# EAGLE design timer (EAGLE 5.07)
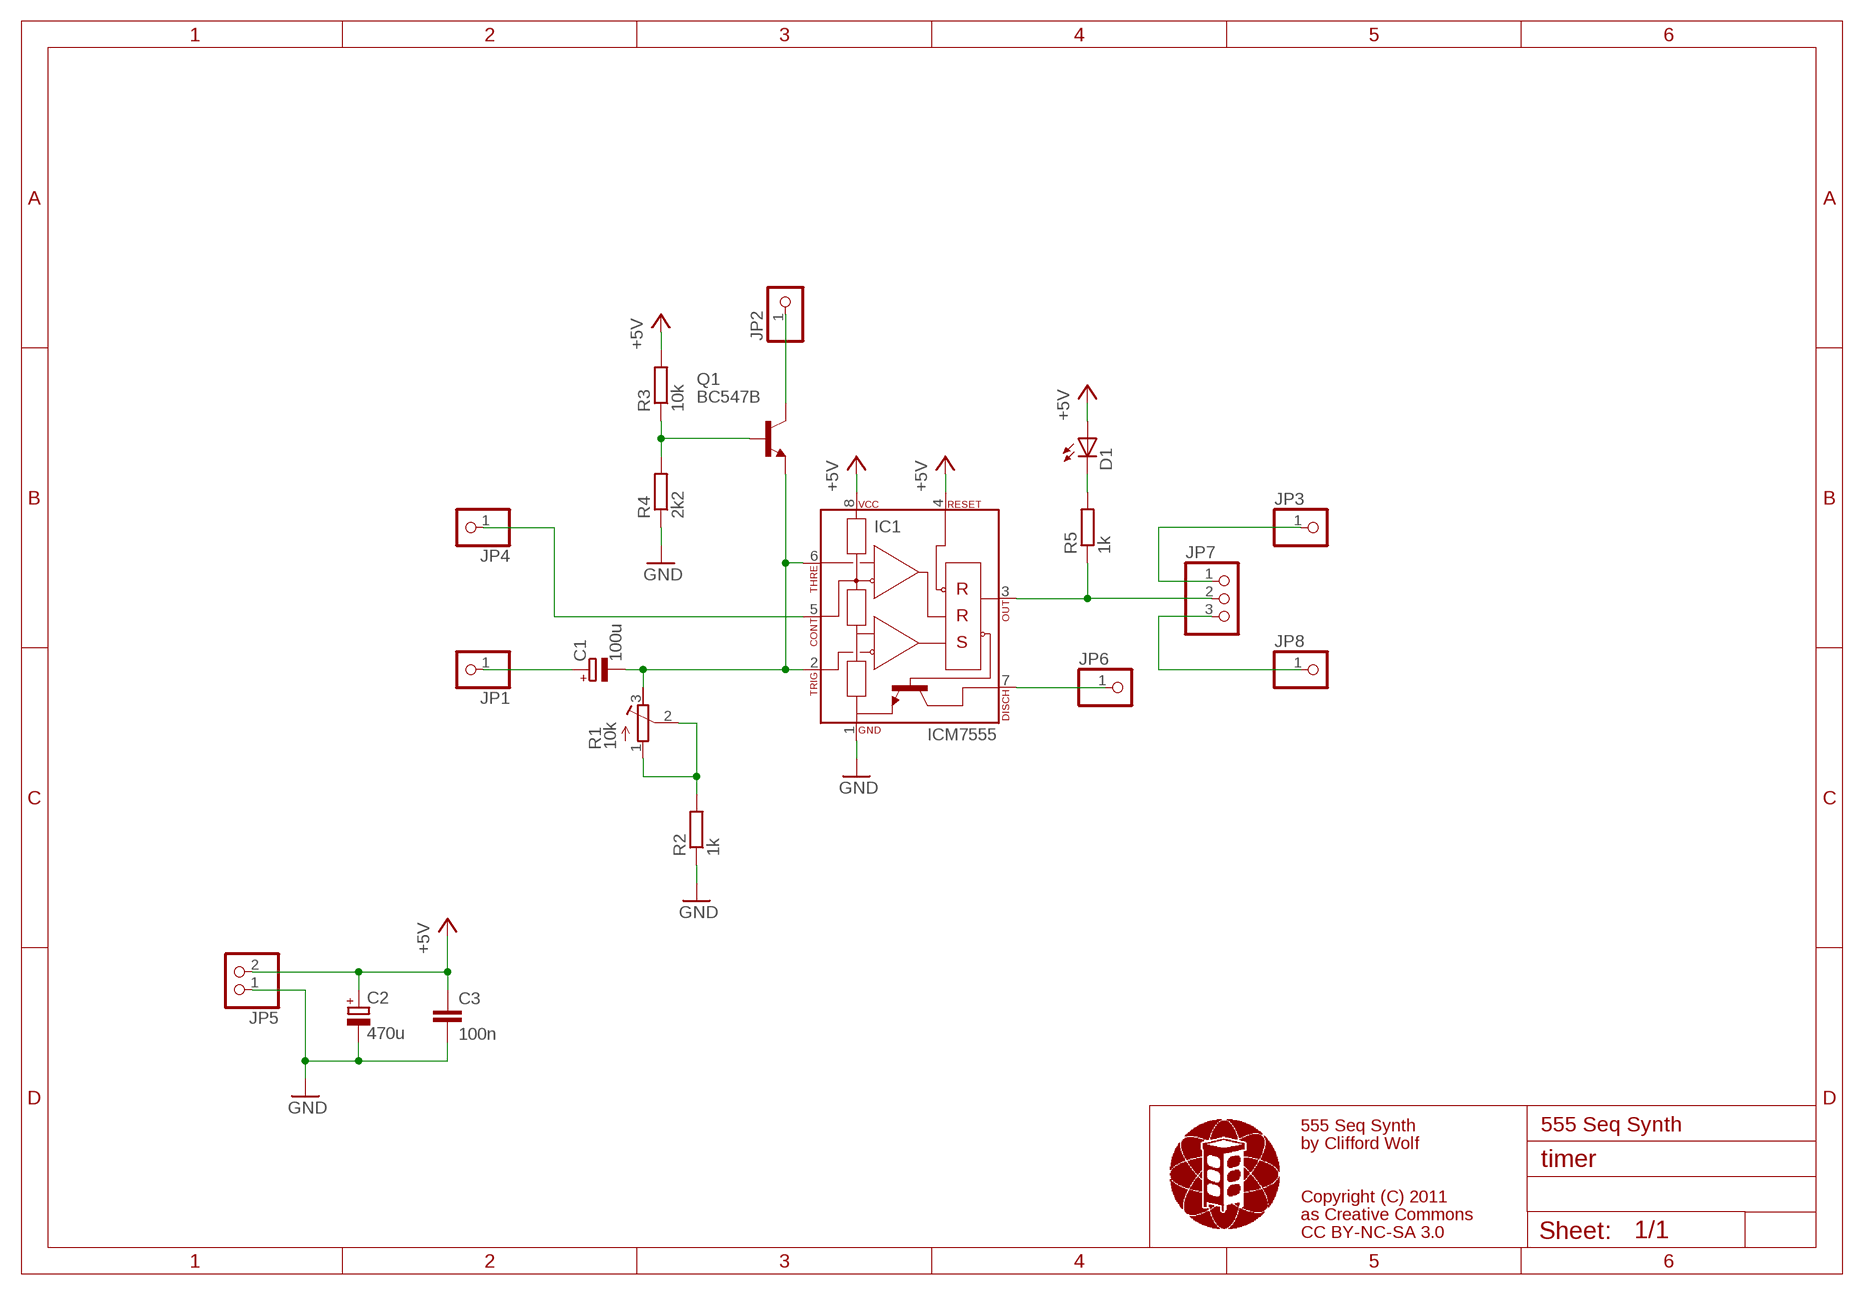
[diagram p0: schematic, sheet 1]

## Parts
C1  100u  CPOLE5-10.5  [E5-10,5]
C2  470u  CPOLE5-10.5  [E5-10,5]
C3  100n  C050-030X075  [C050-030X075]
D1  LED5MM  [LED5MM]
IC1  ICM7555  [DIL08]
JP1  PINHD-1X1  [1X01]
JP2  PINHD-1X1  [1X01]
JP3  PINHD-1X1  [1X01]
JP4  PINHD-1X1  [1X01]
JP5  PINHD-1X2  [1X02]
JP6  PINHD-1X1  [1X01]
JP7  PINHD-1X3  [1X03]
JP8  PINHD-1X1  [1X01]
Q1  BC547B  [TO92]
R1  10k  R-TRIMMRK09K113  [ALPS_RK09K113]
R2  1k  R0309/V  [0309V]
R3  10k  R0309/10  [0309/10]
R4  2k2  R0309/V  [0309V]
R5  1k  R0309/10  [0309/10]

## Nets
+5V: C2.+ C3.1 D1.A IC1.4(RESET) IC1.8(VCC) JP5.2 R3.2
GND: C2.- C3.2 IC1.1(GND) JP5.1 R2.1 R4.1
N$1: C1.+ JP1.1
N$2: C1.- IC1.2(TRIG) IC1.6(THRESH) Q1.1(E) R1.3(A)
N$3: IC1.7(DISCH) JP6.1
N$4: JP3.1 JP7.1
N$5: Q1.2(B) R3.1 R4.2
N$6: JP2.1 Q1.3(C)
N$7: IC1.3(OUT) JP7.2 R5.1
N$8: D1.K(C) R5.2
N$9: IC1.5(CONT) JP4.1
N$10: JP7.3 JP8.1
N$13: R1.1(E) R1.2(S) R2.2

## Notes on the sheet
- 555 Seq Synth | 555 Seq Synth
- by Clifford Wolf
- Copyright (C) 2011
- as Creative Commons
- CC BY-NC-SA 3.0

## Library data of the parts
C1 C2 = mp_passive:CPOL: POLARIZED CAPACITOR, European symbol
C3 = mp_passive:C: CAPACITOR, European symbol
D1 = mp_diode:LED: LED (5mm)
IC1 = mp_miscic:ICM7555: ICM7555 universal RC timer
JP1-JP4 JP6 JP8 = mpc_pinhead:PINHD-1X1: PIN HEADER
JP5 = mpc_pinhead:PINHD-1X2: PIN HEADER
JP7 = mpc_pinhead:PINHD-1X3: PIN HEADER
Q1 = mp_transistor:BC547B: NPN Transistor
R1 = mp_switch:R-TRIMM: Trimm resistor
R2-R5 = mp_passive:R: RESISTOR, European symbol

## Board
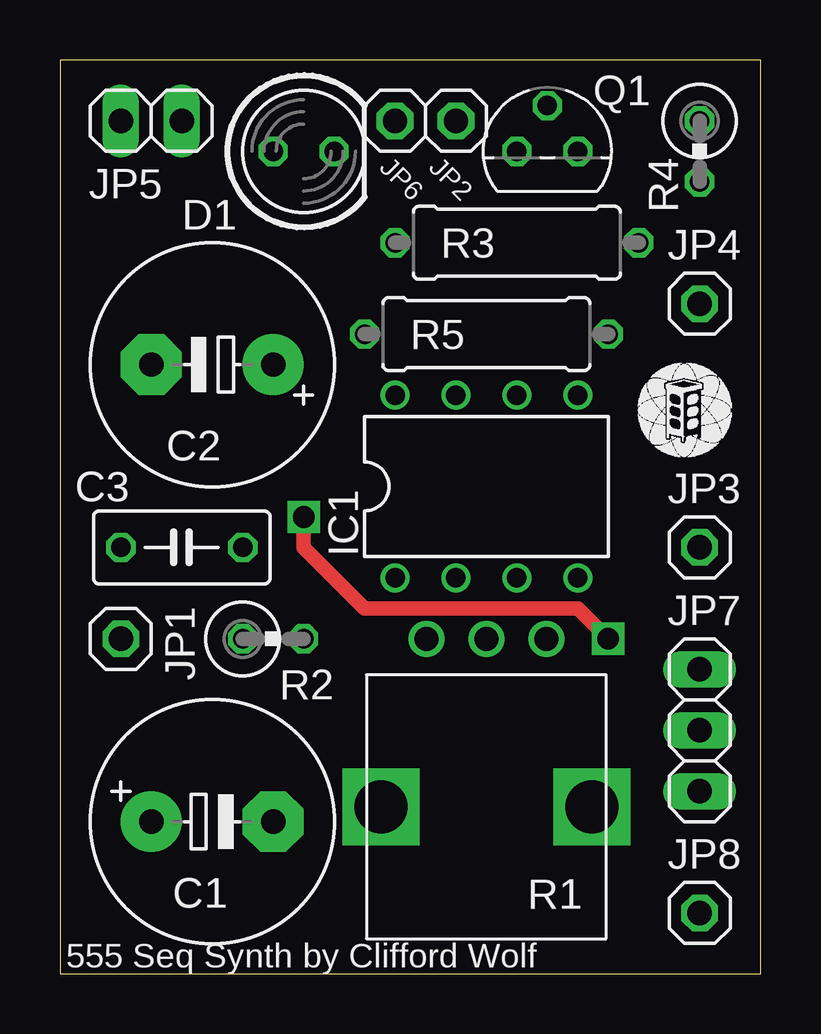
[diagram p1: board, top side]
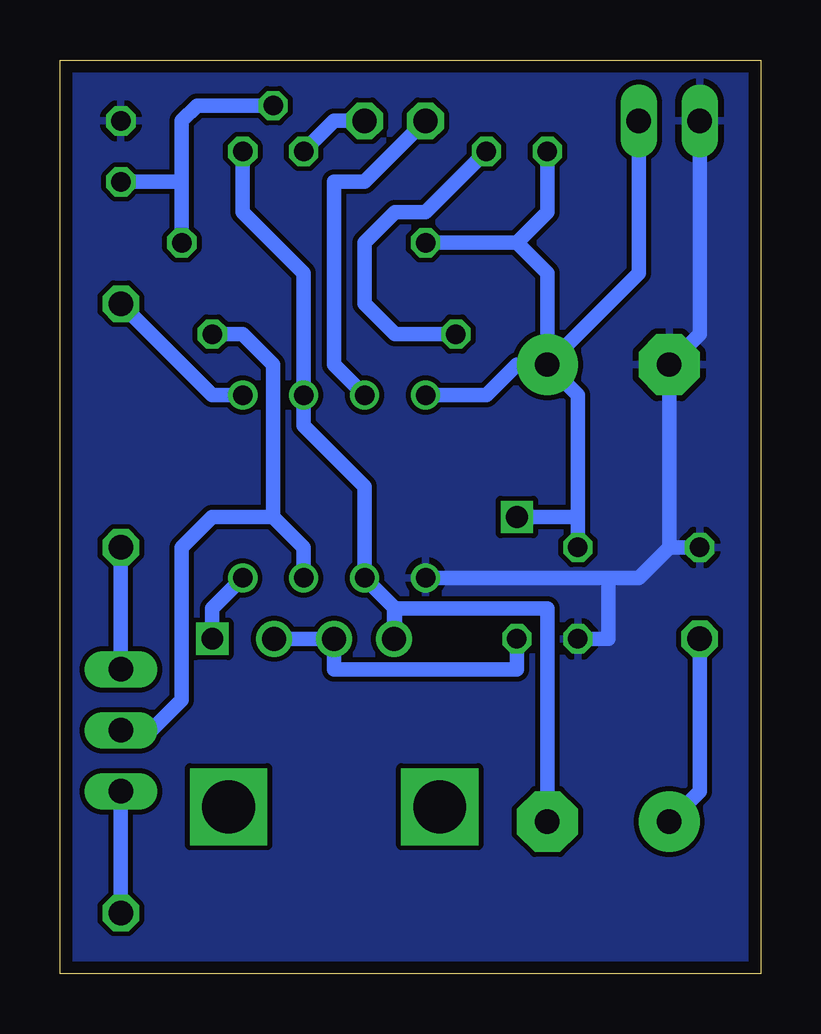
[diagram p2: board, bottom side, seen from below]

Size 29.21 x 38.1 mm. Coordinates in mm from the lower left corner, seen from the top.
Outline: 0,0 29.21,0 29.21,38.1 0,38.1 0,0
Copper layers (1*16): Top 0.035mm / dielectric 1.5mm / Bottom 0.035mm
Design rules "qprules_8mil": minimum track width 8mil, minimum drill 20mil, track to track 8mil, track to pad 8mil, pad to pad 8mil, via to via 8mil, smd to smd 8mil, copper to edge 20mil, drill to drill 20mil, minimum pad ring 8mil, minimum via ring 8mil, stop-mask expansion 0mil, vias tented up to drill 0mil, thermal gap 10mil

### Footprints (pad centres in the part's own frame; a part is rotated, then mirrored left to right if it is on the bottom)
E5-10,5 = drill 1.016 pad 2.54 round: + -2.54,0 | drill 1.016 pad 2.54 octagon: - 2.54,0
C050-030X075 = drill 0.813 octagon: 1 -2.54,0; 2 2.54,0
LED5MM = drill 0.813 octagon: A -1.27,0; K 1.27,0
DIL08 = drill 0.813 round: 1 -3.81,-3.81; 2 -1.27,-3.81; 3 1.27,-3.81; 4 3.81,-3.81; 5 3.81,3.81; 6 1.27,3.81; 7 -1.27,3.81; 8 -3.81,3.81
1X01 = drill 1.016 octagon: 1 0,0
1X02 = drill 1.016 long: 1 -1.27,0; 2 1.27,0
1X03 = drill 1.016 long: 1 -2.54,0; 2 0,0; 3 2.54,0
TO92 = drill 0.813 octagon: 1 1.27,0; 2 0,1.905; 3 -1.27,0
ALPS_RK09K113 = drill 1 round: 1 -2.5,0; 2 0,0; 3 2.5,0 | drill 2.2 square: NC1 -4.4,7; NC2 4.4,7
0309V = drill 0.813 octagon: 1 -1.27,0; 2 1.27,0
0309/10 = drill 0.813 octagon: 1 -5.08,0; 2 5.08,0

### Placement (x,y rotation side)
C1  6.35,6.35 0 top
C2  6.35,25.4 180 top
C3  5.08,17.78 180 top
D1  10.16,34.29 0 top
IC1  17.78,20.32 0 top
JP1  2.54,13.97 270 top
JP2  16.51,35.56 180 top
JP3  26.67,17.78 0 top
JP4  26.67,27.94 0 top
JP5  3.81,35.56 0 top
JP6  13.97,35.56 0 top
JP7  26.67,10.16 270 top
JP8  26.67,2.54 0 top
Q1  20.32,34.29 0 top
R1  17.78,13.97 180 top
R2  8.89,13.97 0 top
R3  19.05,30.48 180 top
R4  26.67,34.29 270 top
R5  17.78,26.67 180 top
U$1  [METALAB_SMALL]  26.04,23.5 0 top

### Tracks (layer width: path | path; a pad name or v marks a point on that pad's centre or on a via)
+5V  (via drill 0.9)
  Top 0.61: v22.86,13.97 21.59,15.24 12.7,15.24 10.16,17.78 v10.16,19.05
  Bottom 0.61: C3.1 7.62,19.05 | 7.62,19.05 7.62,24.13 C2.+ | C2.+ 5.08,29.21 JP5.2 | C2.+ 10.16,25.4 11.43,24.13 IC1.8 | 10.16,30.48 R3.2 | 10.16,30.48 8.89,29.21 C2.+ | D1.A 8.89,31.75 10.16,30.48 | v22.86,13.97 22.86,15.24 IC1.4 | 7.62,19.05 v10.16,19.05
GND
  Bottom 0.61: 3.81,17.78 C3.2 | 6.35,16.51 5.08,16.51 3.81,17.78 | 6.35,16.51 IC1.1 | 3.81,17.78 C2.- 2.54,26.67 JP5.1 | R2.1 6.35,13.97 6.35,16.51
  pour Bottom: 0,38.1 29.21,38.1 29.21,0 0,0
N$1
  Bottom 0.61: JP1.1 2.54,7.62 C1.+
N$2
  Bottom 0.61: C1.- 8.89,15.24 15.24,15.24 15.24,13.97 R1.3 15.28,15.28 IC1.2 16.51,20.32 19.05,22.86 IC1.6 19.05,29.21 21.59,31.75 Q1.1
N$3
  Bottom 0.61: IC1.7 17.78,25.4 17.78,33.02 16.51,33.02 JP6.1
N$4
  Bottom 0.61: JP7.1 JP3.1
N$5
  Bottom 0.61: Q1.2 23.5,36.2 24.13,35.56 24.13,33.02 | R3.1 24.13,33.02 | 24.13,33.02 R4.2
N$6
  Bottom 0.61: Q1.3 17.78,35.56 JP2.1
N$7
  Bottom 0.61: IC1.3 19.05,17.78 20.32,19.05 | 20.32,19.05 20.32,25.4 21.59,26.67 R5.1 | JP7.2 25.4,10.16 24.13,11.43 24.13,17.78 22.86,19.05 20.32,19.05
N$8
  Bottom 0.61: D1.K 13.97,31.75 15.24,31.75 16.51,30.48 16.51,27.94 15.24,26.67 R5.2
N$9
  Bottom 0.61: IC1.5 22.86,24.13 JP4.1
N$10
  Bottom 0.61: JP8.1 JP7.3
N$13
  Bottom 0.61: R1.1 R1.2 17.78,12.7 10.16,12.7 R2.2

### Text on the board
tPlace: 555 Seq Synth by Clifford Wolf